# EAGLE schematic BeagleBone-Stomp-v0.1 (EAGLE 6.3)
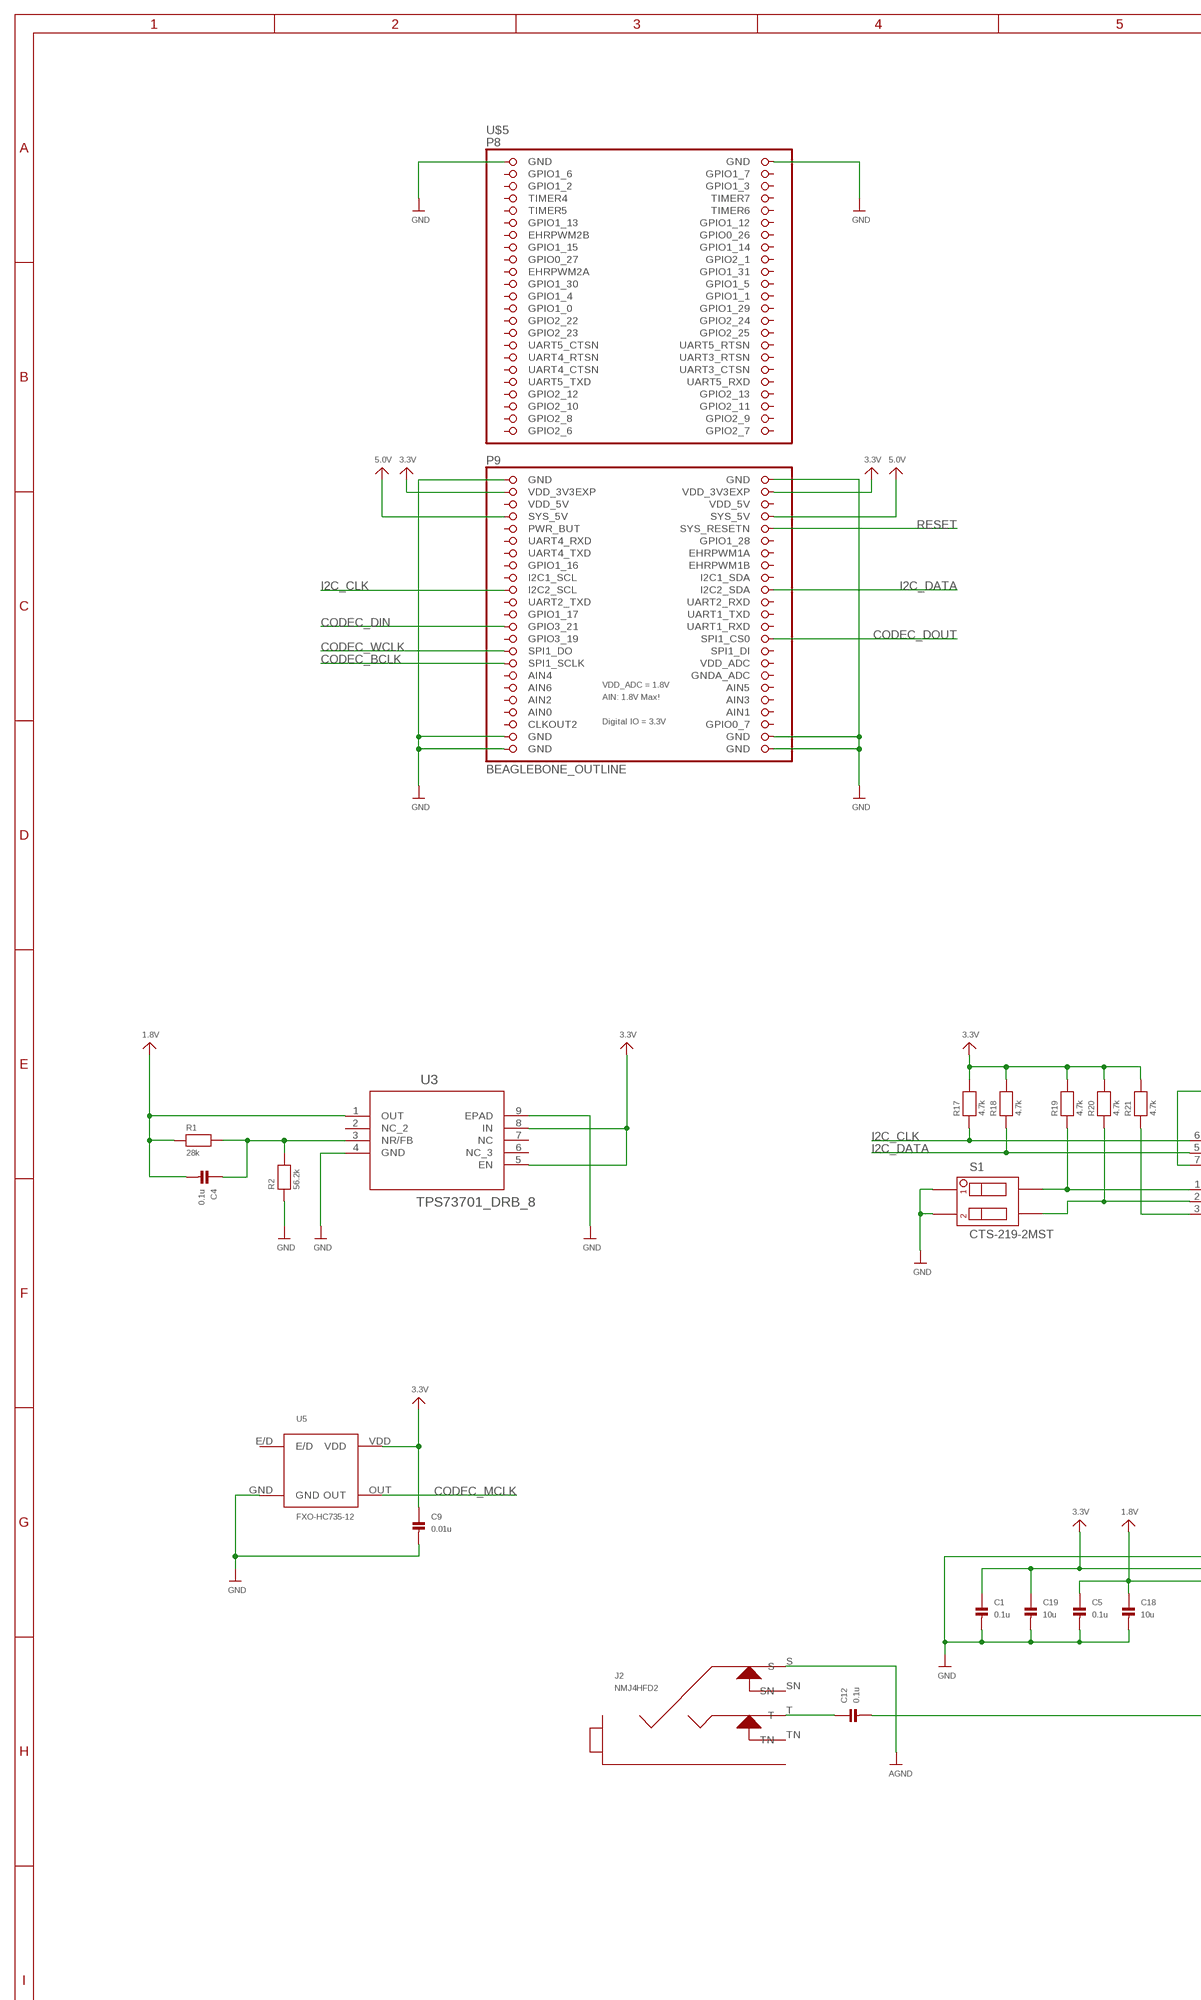
[diagram p0: schematic, sheet 1, part 1 of 2]
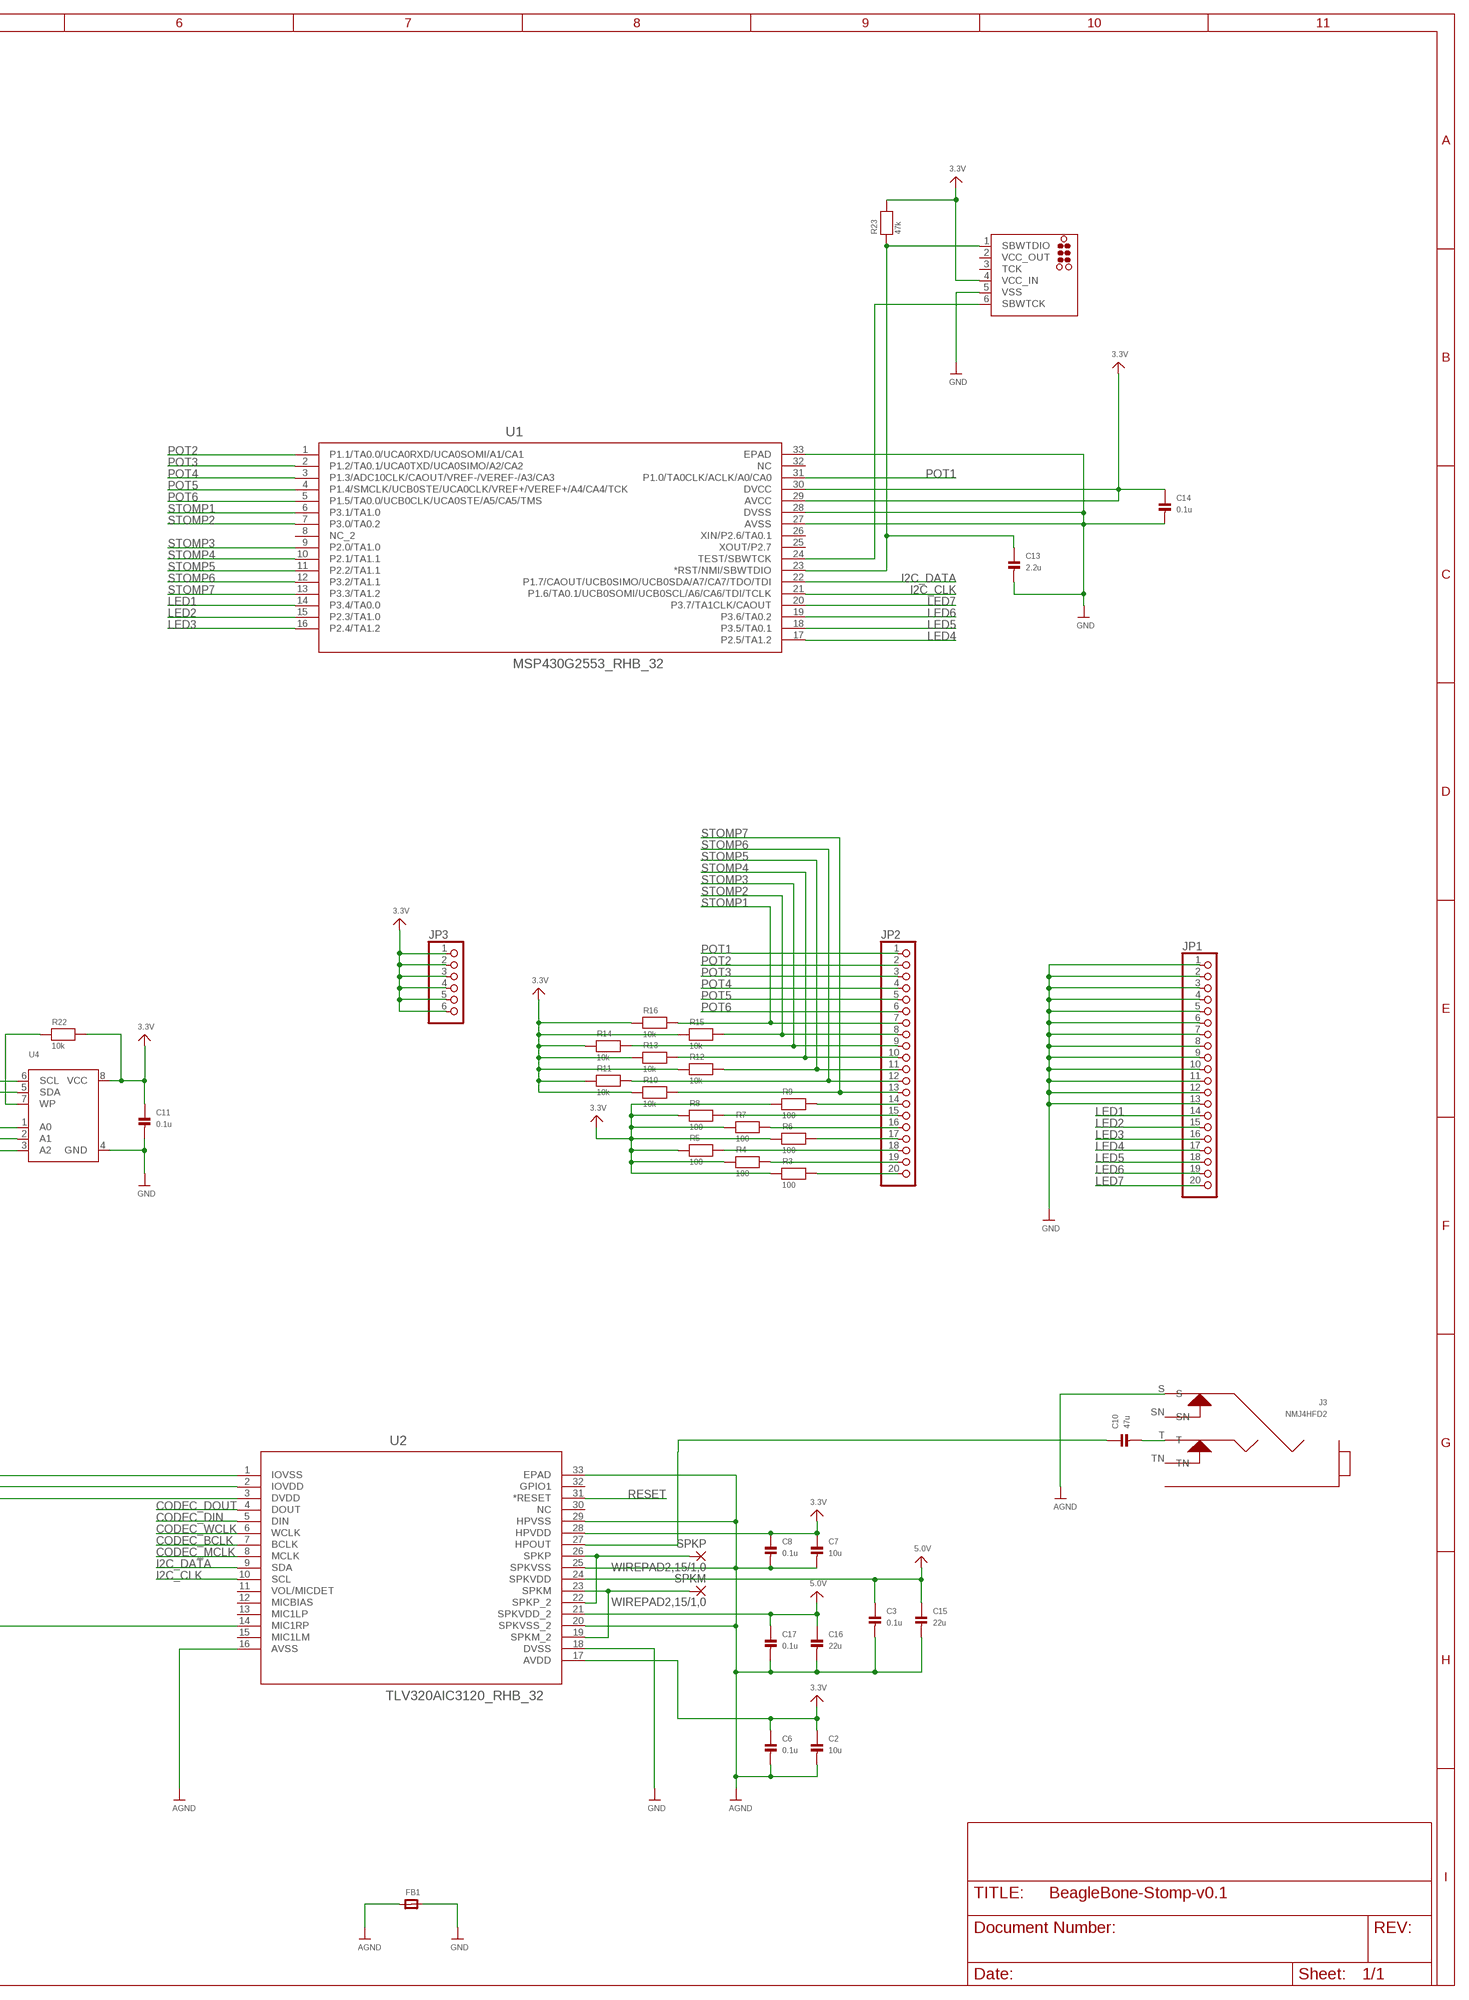
[diagram p1: schematic, sheet 1, part 2 of 2]

## Parts
C1  0.1u  CAP_CERAMIC0402  [0402]
C2  10u  CAP_CERAMIC0805  [0805]
C3  0.1u  CAP_CERAMIC0402  [0402]
C4  0.1u  CAP_CERAMIC0402  [0402]
C5  0.1u  CAP_CERAMIC0402  [0402]
C6  0.1u  CAP_CERAMIC0402  [0402]
C7  10u  CAP_CERAMIC0805  [0805]
C8  0.1u  CAP_CERAMIC0402  [0402]
C9  0.01u  CAP_CERAMIC0402  [0402]
C10  47u  CAP_CERAMIC0805  [0805]
C11  0.1u  CAP_CERAMIC0402  [0402]
C12  0.1u  CAP_CERAMIC0402  [0402]
C13  2.2u  CAP_CERAMIC0402  [0402]
C14  0.1u  CAP_CERAMIC0402  [0402]
C15  22u  CAP_CERAMIC0805  [0805]
C16  22u  CAP_CERAMIC0805  [0805]
C17  0.1u  CAP_CERAMIC0402  [0402]
C18  10u  CAP_CERAMIC0805  [0805]
C19  10u  CAP_CERAMIC0805  [0805]
FB1  FERRITE_0402  [_0402]
J1  TC2030-MCP  [TC2030-MCP]
J2  NMJ4HFD2  [NMJ4HFD2]
J3  NMJ4HFD2  [NMJ4HFD2]
JP1  HEADER-1X20ROUND  [1X20_ROUND]
JP2  HEADER-1X20ROUND  [1X20_ROUND]
JP3  HEADER-1X6ROUND  [1X06_ROUND]
R1  28k  RESISTOR0402  [0402]
R2  56.2k  RESISTOR0402  [0402]
R3  100  RESISTOR0402  [0402]
R4  100  RESISTOR0402  [0402]
R5  100  RESISTOR0402  [0402]
R6  100  RESISTOR0402  [0402]
R7  100  RESISTOR0402  [0402]
R8  100  RESISTOR0402  [0402]
R9  100  RESISTOR0402  [0402]
R10  10k  RESISTOR0402  [0402]
R11  10k  RESISTOR0402  [0402]
R12  10k  RESISTOR0402  [0402]
R13  10k  RESISTOR0402  [0402]
R14  10k  RESISTOR0402  [0402]
R15  10k  RESISTOR0402  [0402]
R16  10k  RESISTOR0402  [0402]
R17  4.7k  RESISTOR0402  [0402]
R18  4.7k  RESISTOR0402  [0402]
R19  4.7k  RESISTOR0402  [0402]
R20  4.7k  RESISTOR0402  [0402]
R21  4.7k  RESISTOR0402  [0402]
R22  10k  RESISTOR0402  [0402]
R23  47k  RESISTOR0402  [0402]
S1  CTS-219-2MST  [CTS-219-2MST]
SPKM  WIREPAD2,15/1,0  [2,15/1,0]
SPKP  WIREPAD2,15/1,0  [2,15/1,0]
U1  MSP430G2553_RHB_32  [RHB32_3P45X3P45]
U2  TLV320AIC3120_RHB_32  [RHB32_3P45X3P45]
U3  TPS73701_DRB_8  [DRB8_1P75X1P5]
U4  EEPROM_I2C_SOIC8_GENERIC  [SOIC8_150MIL]
U5  FXO-HC735-12  [FXO-HC735-12]
U$5  BEAGLEBONE_OUTLINE  [BEAGLEBONE_SHIELD]

## Nets
1.8V: C4.2 C5.1 C18.1 R1.1 U2.3(DVDD) U3.1(OUT)
3.3V: C1.1 C2.1 C6.1 C7.1 C8.1 C9.1 C11.1 C14.1 C19.1 J1.4(VCC_IN) JP3.1 JP3.2 JP3.3 JP3.4 JP3.5 JP3.6 R3.1 R4.1 R5.1 R6.1 R7.1 R8.1 R9.1 R10.1 R11.1 R12.1 R13.1 R14.1 R15.1 R16.1 R17.2 R18.2 R19.2 R20.2 R21.2 R22.2 R23.2 U1.29(AVCC) U1.30(DVCC) U2.2(IOVDD) U2.17(AVDD) U2.28(HPVDD) U3.5(EN) U3.8(IN) U4.8(VCC) U5.VDD U$5.49(VDD_3V3EXP) U$5.50(VDD_3V3EXP)
5.0V: C3.1 C15.1 C16.1 C17.1 U2.21(SPKVDD_2) U2.24(SPKVDD) U$5.53(SYS_5V) U$5.54(SYS_5V)
AGND: C2.2 C3.2 C6.2 C7.2 C8.2 C15.2 C16.2 C17.2 FB1.1 J2.S J3.S U2.16(AVSS) U2.20(SPKVSS_2) U2.25(SPKVSS) U2.29(HPVSS) U2.33(EPAD)
CODEC_BCLK: U2.7(BCLK) U$5.77(SPI1_SCLK)
CODEC_DIN: U2.5(DIN) U$5.71(GPIO3_21)
CODEC_DOUT: U2.4(DOUT) U$5.74(SPI1_CS0)
CODEC_MCLK: U2.8(MCLK) U5.OUT
CODEC_WCLK: U2.6(WCLK) U$5.75(SPI1_DO)
GND: C1.2 C5.2 C9.2 C11.2 C13.2 C14.2 C18.2 C19.2 FB1.2 J1.5(VSS) JP1.1 JP1.2 JP1.3 JP1.4 JP1.5 JP1.6 JP1.7 JP1.8 JP1.9 JP1.10 JP1.11 JP1.12 JP1.13 R2.1 S1.P$1 S1.P$2 U1.27(AVSS) U1.28(DVSS) U1.33(EPAD) U2.1(IOVSS) U2.18(DVSS) U3.4(GND) U3.9(EPAD) U4.4(GND) U5.GND U$5.1(GND) U$5.2(GND) U$5.47(GND) U$5.48(GND) U$5.89(GND) U$5.90(GND) U$5.91(GND) U$5.92(GND)
I2C_CLK: R17.1 U1.21(P1.6/TA0.1/UCB0SOMI/UCB0SCL/A6/CA6/TDI/TCLK) U2.10(SCL) U4.6(SCL) U$5.65(I2C2_SCL)
I2C_DATA: R18.1 U1.22(P1.7/CAOUT/UCB0SIMO/UCB0SDA/A7/CA7/TDO/TDI) U2.9(SDA) U4.5(SDA) U$5.66(I2C2_SDA)
LED1: JP1.14 U1.14(P3.4/TA0.0)
LED2: JP1.15 U1.15(P2.3/TA1.0)
LED3: JP1.16 U1.16(P2.4/TA1.2)
LED4: JP1.17 U1.17(P2.5/TA1.2)
LED5: JP1.18 U1.18(P3.5/TA0.1)
LED6: JP1.19 U1.19(P3.6/TA0.2)
LED7: JP1.20 U1.20(P3.7/TA1CLK/CAOUT)
N$1: C4.1 R1.2 R2.2 U3.3(NR/FB)
N$3: SPKM.1(P) U2.19(SPKM_2) U2.23(SPKM)
N$4: SPKP.1(P) U2.22(SPKP_2) U2.26(SPKP)
N$5: R19.1 S1.P$4 U4.1(A0)
N$6: C10.2 J3.T
N$7: JP2.20 R3.2
N$8: C10.1 U2.27(HPOUT)
N$9: C12.1 J2.T
N$10: C12.2 U2.14(MIC1RP)
N$11: R20.1 S1.P$3 U4.2(A1)
N$12: R21.1 U4.3(A2)
N$13: JP2.14 R9.2
N$14: JP2.15 R8.2
N$15: JP2.16 R7.2
N$16: JP2.17 R6.2
N$18: R22.1 U4.7(WP)
N$22: JP2.18 R5.2
N$23: JP2.19 R4.2
N$32: J1.6(SBWTCK) U1.24(TEST/SBWTCK)
N$33: C13.1 J1.1(SBWTDIO) R23.1 U1.23(*RST/NMI/SBWTDIO)
POT1: JP2.1 U1.31(P1.0/TA0CLK/ACLK/A0/CA0)
POT2: JP2.2 U1.1(P1.1/TA0.0/UCA0RXD/UCA0SOMI/A1/CA1)
POT3: JP2.3 U1.2(P1.2/TA0.1/UCA0TXD/UCA0SIMO/A2/CA2)
POT4: JP2.4 U1.3(P1.3/ADC10CLK/CAOUT/VREF-/VEREF-/A3/CA3)
POT5: JP2.5 U1.4(P1.4/SMCLK/UCB0STE/UCA0CLK/VREF+/VEREF+/A4/CA4/TCK)
POT6: JP2.6 U1.5(P1.5/TA0.0/UCB0CLK/UCA0STE/A5/CA5/TMS)
RESET: U2.31(*RESET) U$5.56(SYS_RESETN)
STOMP1: JP2.7 R16.2 U1.6(P3.1/TA1.0)
STOMP2: JP2.8 R15.2 U1.7(P3.0/TA0.2)
STOMP3: JP2.9 R14.2 U1.9(P2.0/TA1.0)
STOMP4: JP2.10 R13.2 U1.10(P2.1/TA1.1)
STOMP5: JP2.11 R12.2 U1.11(P2.2/TA1.1)
STOMP6: JP2.12 R11.2 U1.12(P3.2/TA1.1)
STOMP7: JP2.13 R10.2 U1.13(P3.3/TA1.2)
Unconnected: J2.SN J2.TN J3.SN J3.TN U1.8(NC_2) U1.25(XOUT/P2.7) U1.26(XIN/P2.6/TA0.1) U1.32(NC) U2.11(VOL/MICDET) U2.12(MICBIAS) U2.13(MIC1LP) U2.15(MIC1LM) U2.30(NC) U2.32(GPIO1) U3.2(NC_2) U3.6(NC_3) U3.7(NC) U5.E/D U$5.3(GPIO1_6) U$5.4(GPIO1_7) U$5.5(GPIO1_2) U$5.6(GPIO1_3) U$5.7(TIMER4) U$5.8(TIMER7) U$5.9(TIMER5) U$5.10(TIMER6) U$5.11(GPIO1_13) U$5.12(GPIO1_12) U$5.13(EHRPWM2B) U$5.14(GPIO0_26) U$5.15(GPIO1_15) U$5.16(GPIO1_14) U$5.17(GPIO0_27) U$5.18(GPIO2_1) U$5.19(EHRPWM2A) U$5.20(GPIO1_31) U$5.21(GPIO1_30) U$5.22(GPIO1_5) U$5.23(GPIO1_4) U$5.24(GPIO1_1) U$5.25(GPIO1_0) U$5.26(GPIO1_29) U$5.27(GPIO2_22) U$5.28(GPIO2_24) U$5.29(GPIO2_23) U$5.30(GPIO2_25) U$5.31(UART5_CTSN) U$5.32(UART5_RTSN) U$5.33(UART4_RTSN) U$5.34(UART3_RTSN) U$5.35(UART4_CTSN) U$5.36(UART3_CTSN) U$5.37(UART5_TXD) U$5.38(UART5_RXD) U$5.39(GPIO2_12) U$5.40(GPIO2_13) U$5.41(GPIO2_10) U$5.42(GPIO2_11) U$5.43(GPIO2_8) U$5.44(GPIO2_9) U$5.45(GPIO2_6) U$5.46(GPIO2_7) U$5.55(PWR_BUT) U$5.57(UART4_RXD) U$5.58(GPIO1_28) U$5.59(UART4_TXD) U$5.60(EHRPWM1A) U$5.61(GPIO1_16) U$5.62(EHRPWM1B) U$5.63(I2C1_SCL) U$5.64(I2C1_SDA) U$5.67(UART2_TXD) U$5.68(UART2_RXD) U$5.69(GPIO1_17) U$5.70(UART1_TXD) U$5.72(UART1_RXD) U$5.73(GPIO3_19) U$5.76(SPI1_DI) U$5.79(AIN4) U$5.81(AIN6) U$5.82(AIN5) U$5.83(AIN2) U$5.84(AIN3) U$5.85(AIN0) U$5.86(AIN1) U$5.87(CLKOUT2) U$5.88(GPIO0_7)

## Power pins joined to a net without a drawn wire
GNDA_ADC: U$5.80(GNDA_ADC)
TCK: J1.3(TCK)
VCC_OUT: J1.2(VCC_OUT)
VDD_5V: U$5.51(VDD_5V) U$5.52(VDD_5V)
VDD_ADC: U$5.78(VDD_ADC)

## Library data of the parts
C1-C19 = microbuilder:CAP_CERAMIC: Ceramic Capacitors 0402 - 0402 Surface Mount Capacitors 16pF 50V 5% [Digikey: 445-4899-2-ND] 18pF 50V 5% [Digikey: 490-1281-2-ND] 22pF 50V 5% [Digikey: 490-1283-2-ND] 68pF 50V 5% [Digikey: 490-1289-2-ND] 0.1uF 10V 10% [Digikey: 490-1318-2-ND] 1.0uF 6.3V 10% [Digikey: 490-1320-2-ND] 0603 - 0603 Surface Mount Capacitors 16 pF 50V 5% [Digikey: 445-5051-2-ND] 22 pF 50V [Digikey: PCC220ACVTR-ND] 33 pF 50V 5% [Digikey: 490-1415-1-ND] 56pF 50V 5% [Digikey: 490-1421-1-ND] 220pF 50V 5% [Digikey: 445-1285-1-ND] 680 pF 50V 2200 pF 50V 5% C0G [Digikey: 445-1297-1-ND] 5600 pF 100V 5% X7R [Digikey: 478-3711-1-ND] 0.1 µF 25V 10% [Digikey: PCC2277TR-ND] 0.22 µF 16V 10% X7R [Digikey: 445-1318-1-ND] 1.0 µF 25V 10% [Digikey: 445-5146-2-ND] 0603 - RF Specific 3pF 250V +/-0.1pF RF [Digikey: 712-1347-1-ND] 18 pF 250V 5% [Digikey: 478-3505-1-ND or 712-1322-1-ND] 56 pF 250V 5% C0G RF [Digikey: 490-4867-1-ND] 68 pF 250V RF [Digikey: 490-4868-1-ND] 0805 - 0805 Surface Mount Capacitors 220 pF 250V 2% RF Ceramic Capacitor [Digikey: 712-1398-1-ND] 1000 pF 50V 2% NP0 Ceramic Capacitor [Digikey: 478-3760-1-ND] 0.1 µF 25V 10% Ceramic Capacitor [Digikey: PCC1828TR-ND] 1.0 µF 16V 10% Ceramic Capacitor[Digikey: 490-1691-2-ND] 10.0 µF 10V 10% Ceramic Capacitor[Digikey: 709-1228-1-ND] 10.0 uF 16V 10% Ceramic Capacitor [Digikey: 478-5165-2-ND] 47 uF 6.3V 20% Ceramic Capacitor [Digikey: 587-1779-1-ND or 399-5506-1-ND] 1206 - 1206 Surface Mount Capacitors 47uF 10V 20% Ceramic Capacitor [Digikey: 490-5528-1-ND or 399-5508-1-ND or 445-6010-1-ND] 100uF 6.3V -20%, +80% Y5V Ceramic Capacitor (Digikey: 490-4512-1-ND, Mouser: 81-GRM31CF50J107ZE1L)
FB1 = microbuilder:FERRITE: Ferrite Bead 0603 MMZ1608B121C - 120 Ohm @ 100MHz, 600mA, 0.15 Ohm DC Resistance - Digikey: 445-2164-1-ND BK1608HW121-T - 120 Ohm, 600mA Ferrite Chip - Digikey: 587-1876-2-ND 0805 HZ0805B272R-10 - 2.7K Ohm @ 100MHz, 200mA, 0.8 Ohm DC Resistance - Digikey: 240-2504-1-ND (see also Murata BLM21BD272SN1L) MMZ2012Y152B - 1.5K Ohm @ 100MHz, 500mA, 0.4 Ohm DC Resistance - Digikey: 445-1560-1-ND - Mainly for high frequency (80-400MHz) MMZ2012R102A - 1K Ohm @ 100MHz, 500mA, 0.3 Ohm DC Resistance - Digikey: 445-1555-2-ND - More general purpose (10-200MHz)
J1 = bone:TC2030: TAG-CONNECT ICSP Connector Manufacturer: Tag-Connect <http://www.tag-connect.com> Cable for easy In-Circuit Serial Programming. Modified for SPY-BI-TAG. Two variants - one "with legs" (for hands-free fit on PCB) and another "without legs" for quick programming. PAD Description 1 SBWTDIO 2 VCC OUT 3 TCK 4 VCC IN 5 VSS 6 SBWTCK ©2009 ROFA.cz - modified by Greg Larmore ‹larmoreg@gmail.com›
J2 J3 = bone:NMJ4HFD2
JP1 JP2 = microbuilder:HEADER-1X20
JP3 = microbuilder:HEADER-1X6: PIN HEADER
R1-R23 = microbuilder:RESISTOR: Resistors 0402 - 0402 Surface Mount Package 22 Ohm 1% 1/16W [Digikey: 311-22.0LRTR-ND] 33 Ohm 5% 1/16W 1.0K 5% 1/16W 1.5K 5% 1/16W 2.0K 1% 1/16W 10.0K 1% 1/16W [Digikey: 311-10.0KLRTR-ND] 10.0K 5% 1/16W [Digikey: RMCF0402JT10K0TR-ND] 12.1K 1% 1/16W [Digikey: 311-22.0LRTR-ND] 100.0K 5% 1/16W 0603 - 0603 Surface Mount Package 0 Ohm 1/10 Watt 1% Resistor 15 Ohm 1/10 Watt 1% Resistor 33 Ohm 1/10 Watt 1% Resistor 49.9 Ohm 1/10 Watt 1% Resistor 100 Ohm 1/10 Watt 1% Resistor 150 Ohm 1/10 Watt 1% Resistor 240 Ohm 1/10 Watt 1% Resistor 390 Ohm 1/10 Watt 1% Resistor 560 Ohm 1/10 Watt 1% Resistor 680 Ohm 1/10 Watt 1% Resistor 750 Ohm 1/10 Watt 1% Resistor 1.0K Ohm 1/10 Watt 1% Resistor 1.5K Ohm 1/10 Watt 1% Resistor 2.0K Ohm 1/10 Watt 1% Resistor 2.2K Ohm 1/10 Watt 1% Resistor 3.3K Ohm 1/10 Watt 1% Resistor 4.7K Ohm 1/10 Watt 1% Resistor 10.0K Ohm 1/10 Watt 1% Resistor 12.0K Ohm 1/10 Watt 1% Resistor 12.1K Ohm 1/10 Watt 1% Resistor 20.0K Ohm 1/10 Watt 1% Resistor 33.0K Ohm 1/10 Watt 1% Resistor 100.0K Ohm 1/10 Watt 1% Resistor 0805 - 0805 Surface Mount Package 0 Ohm 1/8 Watt 1% Resistor 33 Ohm 1/8 Watt 1% Resistor 100 Ohm 1/8 Watt 1% Resistor 150 Ohm 1/8 Watt 1% Resistor 200 Ohm 1/8 Watt 1% Resistor 240 Ohm 1/8 Watt 1% Resistor 330 Ohm 1/8 Watt 1% Resistor 390 Ohm 1/8 Watt 1% Resistor 470 Ohm 1/8 Watt 1% Resistor 1.0K Ohm 1/8 Watt 1% Resistor 1.5K Ohm 1/8 Watt 1% Resistor 2.0K Ohm 1/8 Watt 1% Resistor 4.7K Ohm 1/8 Watt 1% Resistor 5.1K Ohm 1/8 Watt 1% Resistor 5.6K Ohm 1/8 Watt 1% Resistor 10.0K Ohm 1/8 Watt 1% Resistor 22.0K Ohm 1/8 Watt 1% Resistor 33.0K Ohm 1/8 Watt 1% Resistor 100K Ohm 1/8 Watt 1% Resistor 1206 - 1206 Surface Mount Package 2012 - 2010 Surface Mount Package 0.11 Ohm 1/2 Watt 1% Resistor - Digikey: RHM.11UCT-ND
S1 = bone:CTS-219-2MST
SPKM SPKP = wirepad:WIREPAD: Wire PAD connect wire on PCB
U1 = bone:MSP430G2553_RHB_32; DATASHEETURL: http://www.ti.com/lit/gpn/MSP430G2553; DESCRIPTION: MSP430G2x53, MSP430G2x13 Mixed Signal Microcontroller; FAMILY_NAME: Value Line; GENERIC_PART_NUMBER: MSP430G2553; INDUSTRY_STD_PKG_TYPE: QFN; MANUFACTURER: Texas Instruments; MANUFACTURER_PART_NUMBER: msp430g2553_rhb_32; PACKAGE_DESIGNATOR: RHB; PIN_COUNT: 32; VENDOR: Texas Instruments
U2 = bone:TLV320AIC3120_RHB_32; DATASHEETURL: http://www.ti.com/lit/gpn/TLV320AIC3120; DESCRIPTION: Low-Power Audio CODEC With miniDSP and 2.5-W Mono Class-D Speaker Amplifier; FAMILY_NAME: Audio CODEC; GENERIC_PART_NUMBER: TLV320AIC3120; INDUSTRY_STD_PKG_TYPE: QFN; MANUFACTURER: Texas Instruments; MANUFACTURER_PART_NUMBER: tlv320aic3120_rhb_32; PACKAGE_DESIGNATOR: RHB; PIN_COUNT: 32; VENDOR: Texas Instruments
U3 = bone:TPS73701_DRB_8; DATASHEETURL: http://www.ti.com/lit/gpn/TPS73701; DESCRIPTION: Single Output LDO, 1A, Adj. (1.2 to 5.0V), Reverse Current Protection; FAMILY_NAME: SINGLE CHANNEL LDO; GENERIC_PART_NUMBER: TPS73701; INDUSTRY_STD_PKG_TYPE: SON; MANUFACTURER: Texas Instruments; MANUFACTURER_PART_NUMBER: tps73701_drb_8; PACKAGE_DESIGNATOR: DRB; PIN_COUNT: 8; VENDOR: Texas Instruments
U4 = microbuilder:EEPROM_I2C_SOIC8_GENERIC: Note: The same pinout is used for many I2C EEPROMs in SOIC8(150mil) from a variety of manufacturers and in various sizes. Examples: 16K (2K x 8 Bit) I2C EEPROM 1.7-5.5V, 400KHz, -40°C-85°C Digikey: CAT24C16WI-GT3CT-ND 256K (32K x 8 Bit) I2C EEPROM 1.7-5.5V, 400KHz, -40°C-85°C Digikey: 24AA256-I/SN-ND
U5 = bone:FXO-HC735-12
U$5 = bone:BEAGLEBONE_OUTLINE